# Altium schematic sheet 04_HV_Bus_Sense.SchDoc
size A4; SheetNumber: 4; SheetTotal: 6
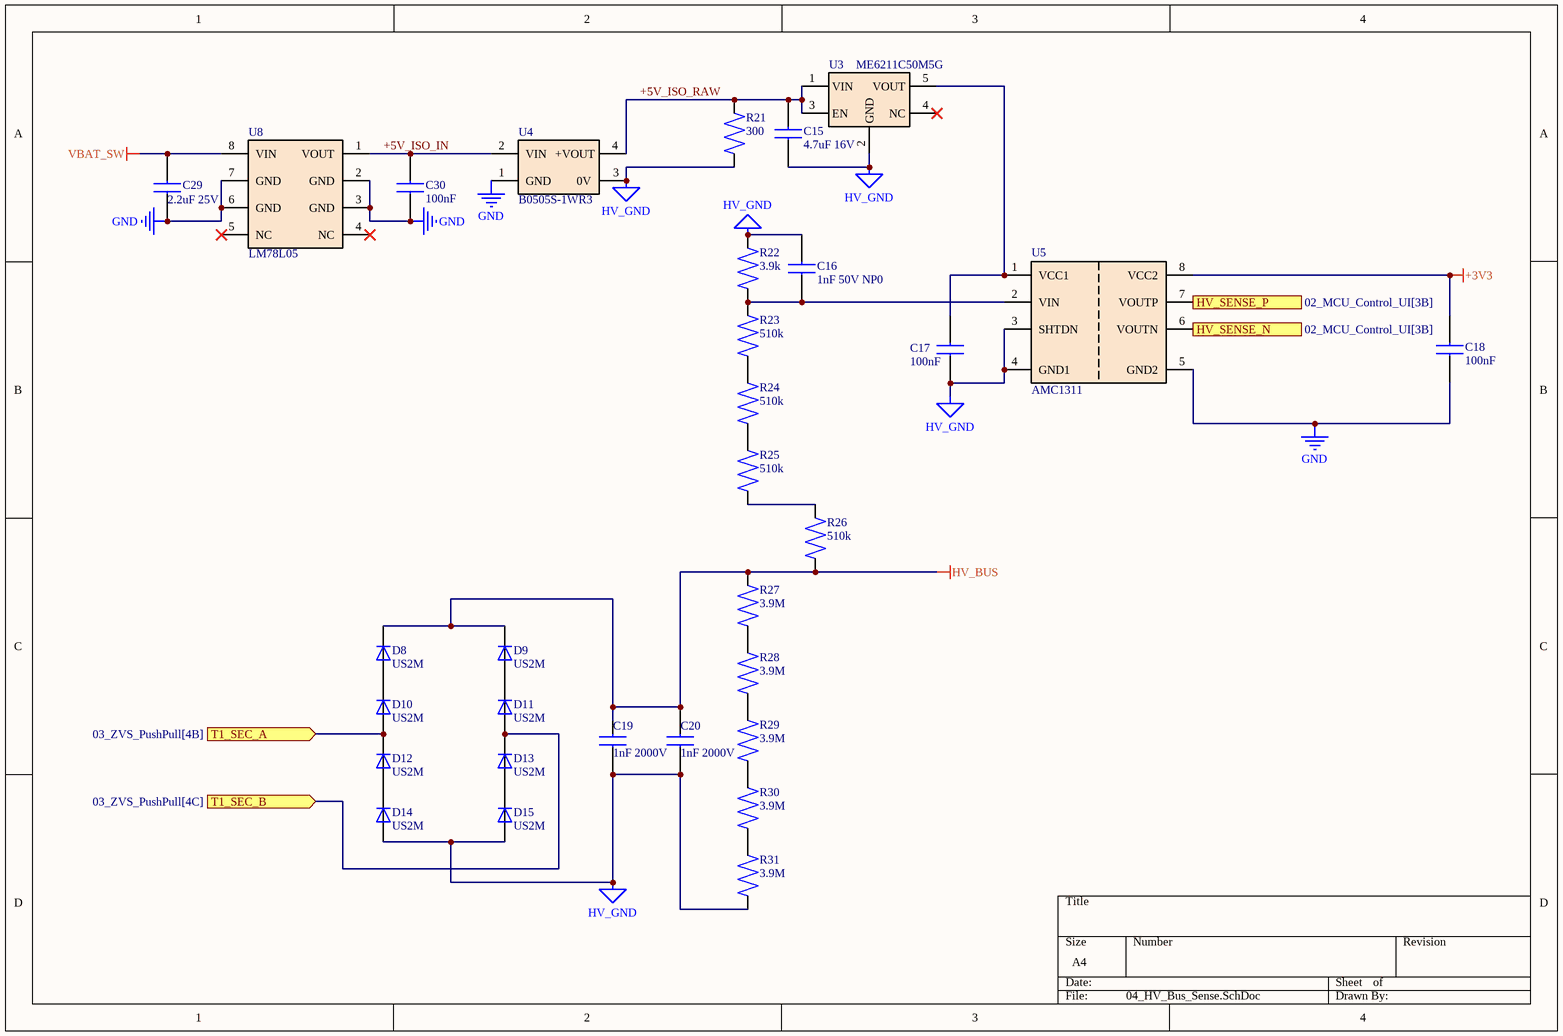
[diagram p0: 04_HV_Bus_Sense.SchDoc]

## Parts
C15  4.7uF 16V  [CHIP_0805_SMD]
C16  1nF 50V NP0  [CHIP_0603_SMD]
C17  100nF  [CHIP_0603_SMD]
C18  100nF  [CHIP_0603_SMD]
C19  1nF 2000V  [CAP_FILM_P15.0_CBB81_HEAVY_DUTY]
C20  1nF 2000V  [CAP_FILM_P15.0_CBB81_HEAVY_DUTY]
C29  2.2uF 25V  [CHIP_0805_SMD]
C30  100nF  [CHIP_0603_SMD]
D8  US2M  [DIODE_DO-214AC_SMA]
D9  US2M  [DIODE_DO-214AC_SMA]
D10  US2M  [DIODE_DO-214AC_SMA]
D11  US2M  [DIODE_DO-214AC_SMA]
D12  US2M  [DIODE_DO-214AC_SMA]
D13  US2M  [DIODE_DO-214AC_SMA]
D14  US2M  [DIODE_DO-214AC_SMA]
D15  US2M  [DIODE_DO-214AC_SMA]
R21  300  [CHIP_0805_SMD]
R22  3.9k  [CHIP_0603_SMD]
R23  510k  [CHIP_1206_SMD]
R24  510k  [CHIP_1206_SMD]
R25  510k  [CHIP_1206_SMD]
R26  510k  [CHIP_1206_SMD]
R27  3.9M  [CHIP_1206_SMD]
R28  3.9M  [CHIP_1206_SMD]
R29  3.9M  [CHIP_1206_SMD]
R30  3.9M  [CHIP_1206_SMD]
R31  3.9M  [CHIP_1206_SMD]
U3  ME6211C50M5G  [SOT-23-5_M5_HANDSOLDER]
U4  B0505S-1WR3  [CONV_DC-DC_MORNSUN_SIP-4_11.6x6.0]
U5  AMC1311  [SOIC-8-DWV_WIDE_HANDSOLDER]
U8  LM78L05  [SOIC-8_1.27_4.9x3.9mm]

## Ports
HV_SENSE_N (out, see 02_MCU_Control_UI[3B]), HV_SENSE_P (out, see 02_MCU_Control_UI[3B]), T1_SEC_A (in, see 03_ZVS_PushPull[4B]), T1_SEC_B (in, see 03_ZVS_PushPull[4C])

## Nets
+3V3: C18.2 U5.8(VCC2)
GND: C18.1 C29.1 C30.1 U4.1(GND) U5.5(GND2) U8.2(GND) U8.3(GND) U8.6(GND) U8.7(GND)
HV_BUS: C19.2 C20.2 D8.1(K) D9.1(K) R26.1 R27.2
HV_GND: C15.1 C16.2 C17.1 C19.1 C20.1 D14.2(A) D15.2(A) R21.1 R22.2 R31.1 U3.2(GND) U4.3(0V) U5.3(SHTDN) U5.4(GND1)
VBAT_SW: C29.2 U8.8(VIN)
+5V_ISO_IN: C30.2 U4.2(VIN) U8.1(VOUT)
+5V_ISO_RAW: C15.2 R21.2 U3.1(VIN) U3.3(EN) U4.4(+VOUT)
HV_SENSE_N: U5.6(VOUTN) ; port HV_SENSE_N
HV_SENSE_P: U5.7(VOUTP) ; port HV_SENSE_P
T1_SEC_A: D10.2(A) D12.1(K) ; port T1_SEC_A
T1_SEC_B: D11.2(A) D13.1(K) ; port T1_SEC_B
NetC16_1: C16.1 R22.1 R23.2 U5.2(VIN)
NetC17_2: C17.2 U3.5(VOUT) U5.1(VCC1)
NetD8_2: D8.2(A) D10.1(K)
NetD9_2: D9.2(A) D11.1(K)
NetD12_2: D12.2(A) D14.1(K)
NetD13_2: D13.2(A) D15.1(K)
NetR23_1: R23.1 R24.2
NetR24_1: R24.1 R25.2
NetR25_1: R25.1 R26.2
NetR27_1: R27.1 R28.2
NetR28_1: R28.1 R29.2
NetR29_1: R29.1 R30.2
NetR30_1: R30.1 R31.2

Not connected (* = marked no-connect by the designer): U3 4(NC)*; U8 4(NC)* 5(NC)*

## Library data of the parts
C15 = CAP_0805_4.7uF_16V_X7R: Capacitor MLCC, Ceramic, 4.7 uF, 16 V, ±10%, X7R, SMD 0805, Bypass / Decoupling, Samsung / Murata
C16 = CAP_0603_1nF_50V_NP0: Capacitor MLCC, Ceramic, 1 nF, 50 V, ±5%, C0G/NP0, SMD 0603, High Frequency Filter, Samsung Electro-Mechanics
C17 C18 C30 = CAP_0603_100nF_50V_X7R: Capacitor MLCC, Ceramic, 100 nF, 50 V, ±10%, X7R, SMD 0603, Samsung Electro-Mechanics; Part Number:: CL10B104KB8NNNC
C19 C20 = CAP_FILM_CBB81_1nF_2000V: Capacitor Film, Metallized Polypropylene (PP), 1nF, 2000 VDC (2 kV), ±5%, Radial THT, High Pulse / Snubber, CBB81
C29 = CAP_0805_2.2uF_25V_X7R: Capacitor MLCC, Ceramic, 2.2 uF, 25 V, ±10%, X7R, SMD 0805, Hitano Enterprise
D8-D15 = DIODE_ULTRAFAST_US2M_SMA: Ultrafast High Voltage Surface Mount Rectifier, 1000V, 2A, trr=75ns, Vf=1.7V, SMA (DO-214AC)
R21 = RES_0805_300R_1%: Resistor, 300 Ohm, ±1%, 0.125W (1/8W), 150V, SMD 0805, Thick Film, Yageo
R22 = RES_0603_3.9k_1%: Resistor, 3.9 kOhm, ±1%, 0.1W (1/10W), 75V, SMD 0603, Thick Film, Yageo
R23-R26 = RES_1206_510k_1%: Resistor, 510 kOhm, ±1%, 0.25W (1/4W), 200V, SMD 1206, High Voltage Divider, Thick Film, Yageo
R27-R31 = RES_1206_3.9M_5%: Resistor, 3.9 MOhm, ±5%, 0.25W (1/4W), 200V, SMD 1206, Bleeder / High Resistance, Thick Film, Hitano
U3 = IC_REG_LDO_ME6211C50M5G: LDO Voltage Regulator, Fixed 5.0V, 500mA, Low Noise, High PSRR, SOT-23-5, Microne
U4 = MODULE_DCDC_B0505S-1WR3: Isolated DC-DC Converter, 5V In, 5V Out, 1W (200mA), 3000 VDC Isolation, Unregulated, SIP-4, Mornsun
U5 = IC_ISO_AMP_AMC1311BDWVR: Precision Isolated Amplifier, 0V to 2V Input, 5kVrms Isolation, High CMTI (100kV/us), SOIC-8 Wide (DWV), Texas Instruments
U8 = MODULE_LDO_LM78L05_SO8: IC REG LINEAR 5V 100MA SOIC-8, Vin up to 30V